# EAGLE design BEP31_RPM_BAR switchedRES_2 (EAGLE 6.5.0)
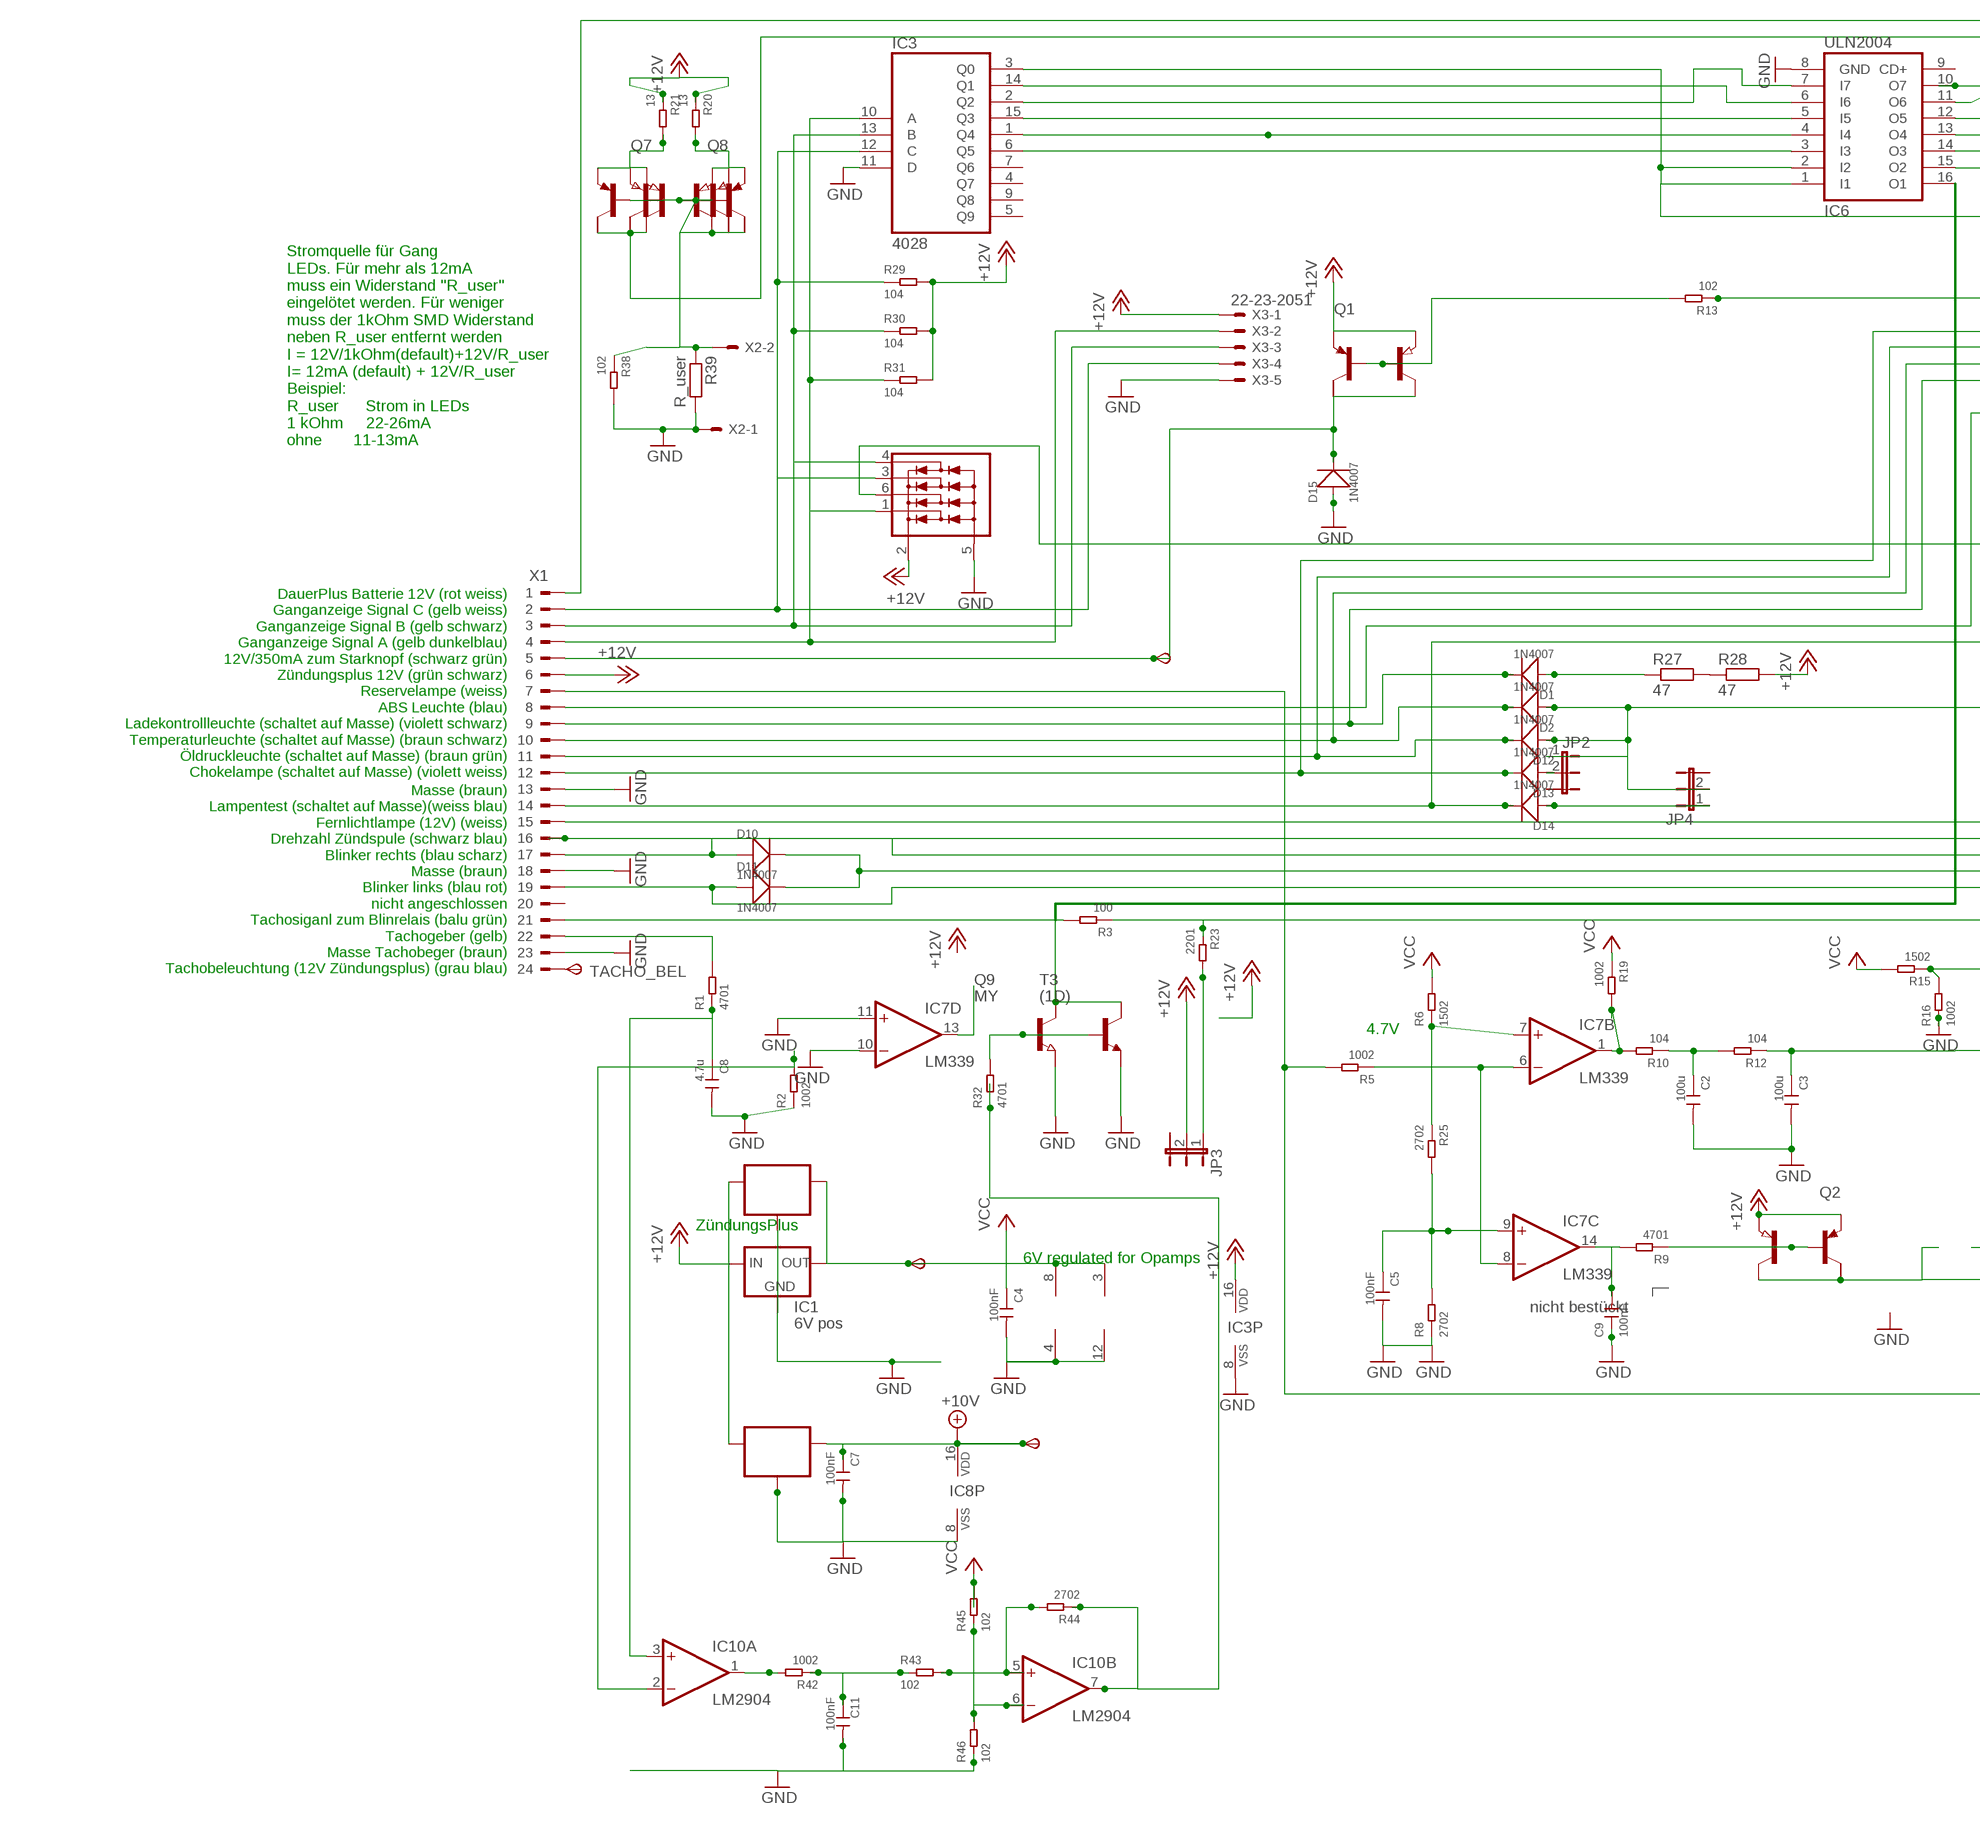
[diagram p0: schematic, sheet 1, part 1 of 2]
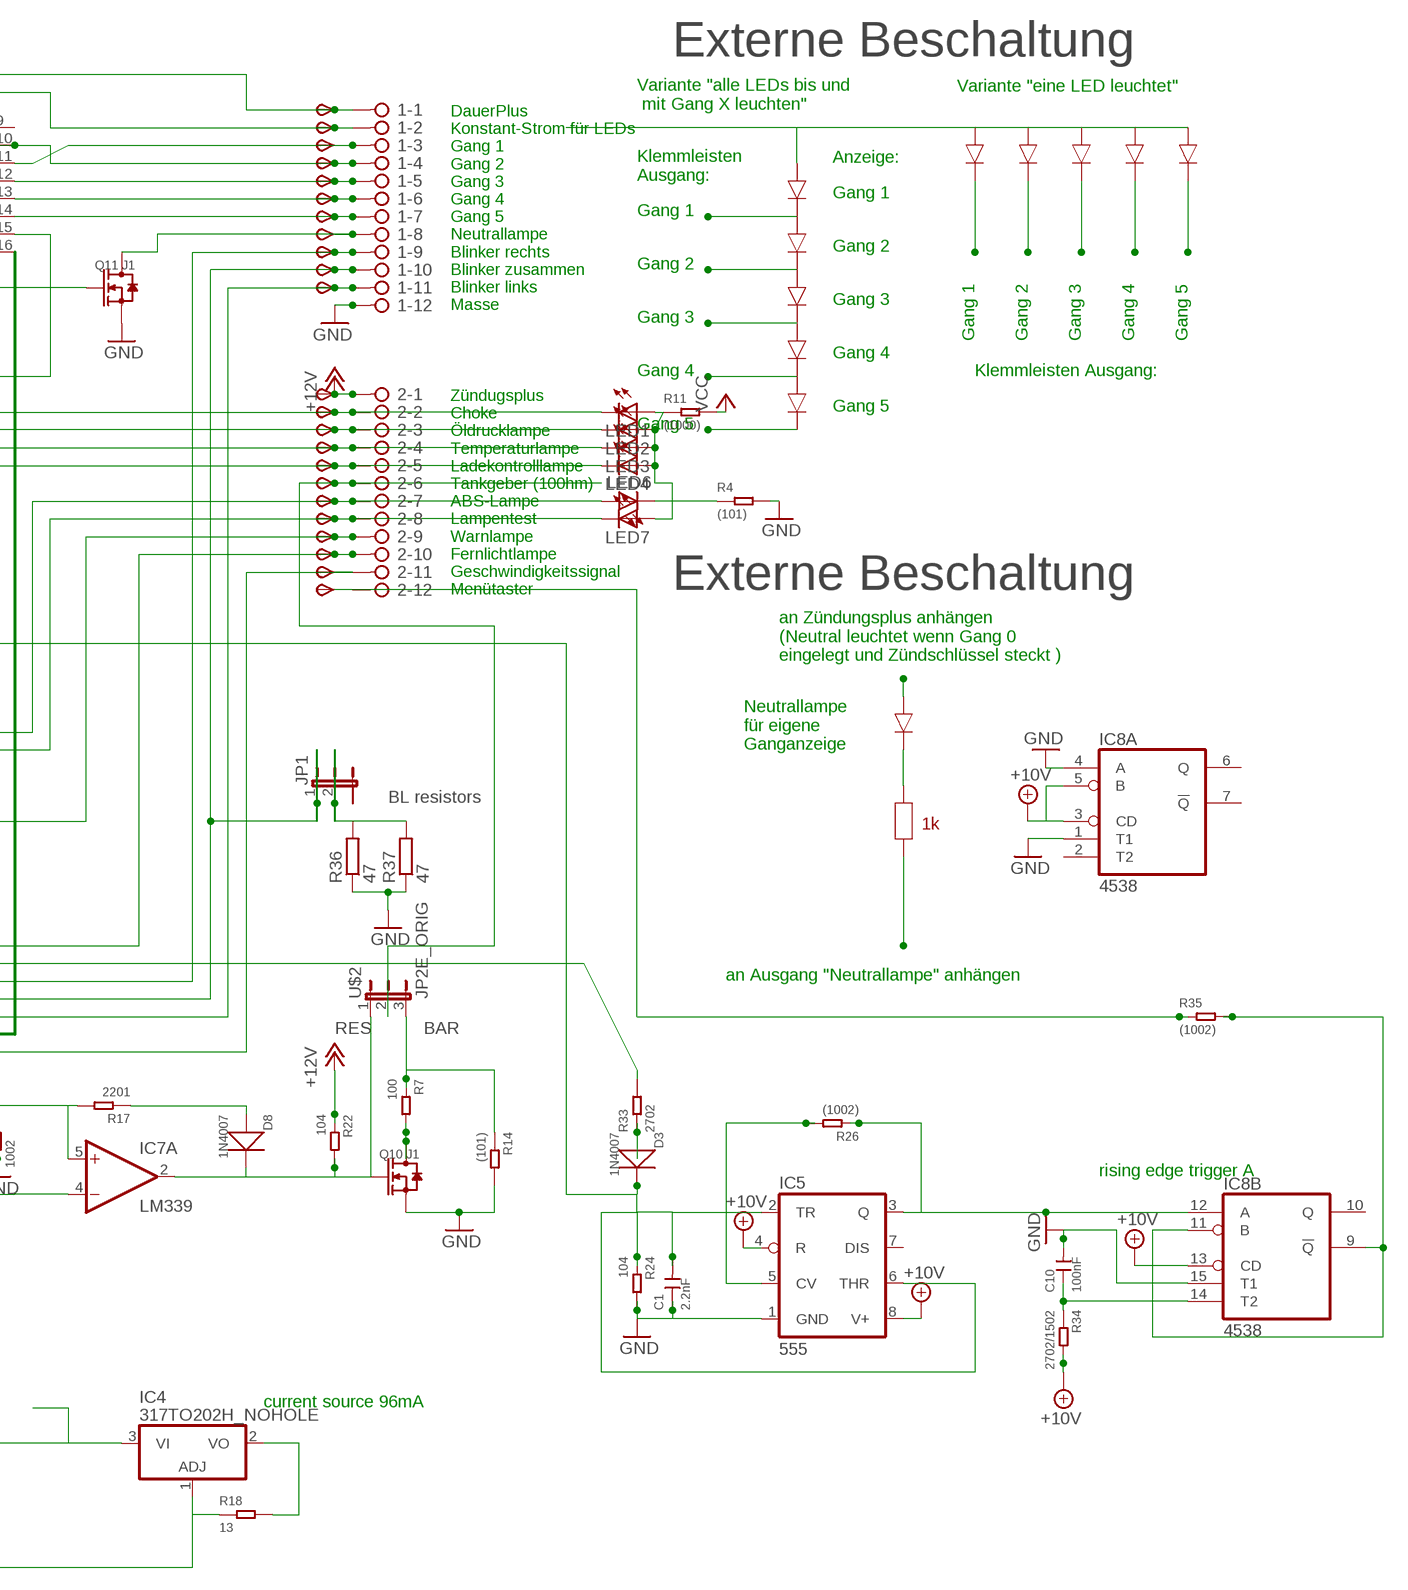
[diagram p1: schematic, sheet 1, part 2 of 2]

## Parts
1  2081-1132  [12-PIN]
2  2081-1132  [12-PIN]
6V  TPSB2.0  [B2.0]
10V  TPSB2.0  [B2.0]
C1  2.2nF  CERAMIC-100NF-50V-10%-X7R(0805)  [C0805]
C2  100u  CERAMIC-100UF-6.3V-20%-X5R(1206)  [C1206]
C3  100u  CERAMIC-100UF-6.3V-20%-X5R(1206)  [C1206]
C4  100nF  CERAMIC-100NF-50V-10%-X7R(0805)  [C0805]
C5  100nF  CERAMIC-100NF-50V-10%-X7R(0805)  [C0805]
C7  100nF  CERAMIC-100NF-50V-10%-X7R(0805)  [C0805]
C8  4.7u  CERAMIC-4.7UF-25V-10%-X5R(0805)  [C0805]
C9  100nF  CERAMIC-100NF-50V-10%-X7R(0805)  [C0805]
C10  100nF  CERAMIC-100NF-50V-10%-X7R(0805)  [C0805]
C11  100nF  CERAMIC-100NF-50V-10%-X7R(0805)  [C0805]
D1  1N4007  DIODE-GEN-PURPOSE-1KV-1A(DO-214AC)  [DO-214AC]
D2  1N4007  DIODE-GEN-PURPOSE-1KV-1A(DO-214AC)DO-214AC/1206  [DO-214AC-1206MOUNT]
D3  1N4007  DIODE-GEN-PURPOSE-1KV-1A(DO-214AC)  [DO-214AC]
D8  1N4007  DIODE-GEN-PURPOSE-1KV-1A(DO-214AC)  [DO-214AC]
D10  1N4007  DIODE-GEN-PURPOSE-1KV-1A(DO-214AC)  [DO-214AC]
D11  1N4007  DIODE-GEN-PURPOSE-1KV-1A(DO-214AC)  [DO-214AC]
D12  1N4007  DIODE-GEN-PURPOSE-1KV-1A(DO-214AC)DO-214AC/1206  [DO-214AC-1206MOUNT]
D13  1N4007  DIODE-GEN-PURPOSE-1KV-1A(DO-214AC)DO-214AC/1206  [DO-214AC-1206MOUNT]
D14  1N4007  DIODE-GEN-PURPOSE-1KV-1A(DO-214AC)DO-214AC/1206  [DO-214AC-1206MOUNT]
D15  1N4007  DIODE-GEN-PURPOSE-1KV-1A(DO-214AC)  [DO-214AC]
IC1  6V pos  78LXX  [78LXX]
IC2  78LXXSOT89_ROUND  [SOT89_ROUND]
IC3  4028  4028D  [SO16]
IC4  317TO202H_NOHOLE  [TO220H_NOHOLE]
IC5  555  NE555D  [SO08]
IC6  ULN2004  ULN2004AD  [SO16]
IC7  LM339  LM339D  [SO14]
IC8  4538  4538D  [SO16]
IC9  78LXXSOT89_ROUND  [SOT89_ROUND]
IC10  LM2904  LM358D  [SO08]
JP1  JP2EJP2_SMALLPADS  [JP2_SMALLPADS]
JP2  JP2EJP2_SMALLPADS  [JP2_SMALLPADS]
JP3  JP2EJP2_SMALLPADS  [JP2_SMALLPADS]
JP4  JP2EJP2_SMALLPADS  [JP2_SMALLPADS]
LED1  LEDLD260  [LD260]
LED2  LEDLD260  [LD260]
LED3  LEDLD260  [LD260]
LED4  LEDLD260  [LD260]
LED6  LEDLD260  [LD260]
LED7  LEDLD260  [LD260]
Q1  PNP-TRANSISTOR_SOT89  [SOT89]
Q2  PNP-TRANSISTOR_SOT89  [SOT89]
Q3  AH-16  BCP53T1  [SOT223]
Q4  (AH-16)  BCP53T1  [SOT223]
Q5  (AH-16)  BCP53T1  [SOT223]
Q6  (AH-16)  BCP53T1  [SOT223]
Q7  PNP-TRANSISTOR_SOT89  [SOT89]
Q8  PNP-TRANSISTOR_SOT89  [SOT89]
Q9  MY  NPN-TRANSISTOR_SOT89  [SOT89]
Q10  J1  SMD-MOSFET-N-CH-50V-200MA-BSS138W-7-F(SOT-23)  [SOT-23]
Q11  J1  SMD-MOSFET-N-CH-50V-200MA-BSS138W-7-F(SOT-23)  [SOT-23]
R1  4701  SMD-RES-4.7K-5%-1/8W(0805)  [R0805]
R2  1002  SMD-RES-10K-1%-1/8W(0805)  [R0805]
R3  100  SMD-RES-220R-5%-1/8W(0805)  [R0805]
R4  (101)  SMD-RES-100R-5%-1/8W(0805)  [R0805]
R5  1002  SMD-RES-10K-1%-1/8W(0805)  [R0805]
R6  1502  SMD-RES-10K-1%-1/8W(0805)  [R0805]
R7  100  SMD-RES-2.2K-5%-1/8W(0805)  [R0805]
R8  2702  SMD-RES-4.7K-5%-1/8W(0805)  [R0805]
R9  4701  SMD-RES-4.7K-5%-1/8W(0805)  [R0805]
R10  104  SMD-RES-10K-1%-1/8W(0805)  [R0805]
R11  (1000)  SMD-RES-100R-5%-1/8W(0805)  [R0805]
R12  104  SMD-RES-10K-1%-1/8W(0805)  [R0805]
R13  102  SMD-RES-1K-5%-1/8W(0805)  [R0805]
R14  (101)  SMD-RES-2.2K-5%-1/8W(0805)  [R0805]
R15  1502  SMD-RES-10K-1%-1/8W(0805)  [R0805]
R16  1002  SMD-RES-10K-1%-1/8W(0805)  [R0805]
R17  2201  SMD-RES-2.2K-5%-1/8W(0805)  [R0805]
R18  13  SMD-RES-13R-5%-1/4W(1206)  [R1206]
R19  1002  SMD-RES-10K-1%-1/8W(0805)  [R0805]
R20  13  SMD-RES-13R-5%-1/4W(1206)  [R1206]
R21  13  SMD-RES-13R-5%-1/4W(1206)  [R1206]
R22  104  SMD-RES-10K-1%-1/8W(0805)  [R0805]
R23  2201  SMD-RES-2.2K-5%-1/8W(0805)  [R0805]
R24  104  SMD-RES-10K-1%-1/8W(0805)  [R0805]
R25  2702  SMD-RES-4.7K-5%-1/8W(0805)  [R0805]
R26  (1002)  SMD-RES-10K-1%-1/8W(0805)  [R0805]
R27  47  R-EU_V235/17_1MM  [V235/17_1MM]
R28  47  R-EU_V235/17_1MM  [V235/17_1MM]
R29  104  SMD-RES-10K-1%-1/8W(0805)  [R0805]
R30  104  SMD-RES-10K-1%-1/8W(0805)  [R0805]
R31  104  SMD-RES-10K-1%-1/8W(0805)  [R0805]
R32  4701  SMD-RES-4.7K-5%-1/8W(0805)  [R0805]
R33  2702  SMD-RES-10K-1%-1/8W(0805)  [R0805]
R34  2702/1502  SMD-RES-4.7K-5%-1/8W(0805)  [R0805]
R35  (1002)  SMD-RES-4.7K-5%-1/8W(0805)  [R0805]
R36  47  R-EU_V235/17_1MM  [V235/17_1MM]
R37  47  R-EU_V235/17_1MM  [V235/17_1MM]
R38  102  SMD-RES-1K-5%-1/8W(0805)  [R0805]
R39  R_user  R-EU_R0805  [R0805]
R42  1002  SMD-RES-10K-1%-1/8W(0805)  [R0805]
R43  102  SMD-RES-1K-5%-1/8W(0805)  [R0805]
R44  2702  SMD-RES-4.7K-5%-1/8W(0805)  [R0805]
R45  102  SMD-RES-1K-5%-1/8W(0805)  [R0805]
R46  102  SMD-RES-1K-5%-1/8W(0805)  [R0805]
START  TPSB2.0  [B2.0]
T1  PNP2SM8  [SM8]
T3  (1D)  MMBTA42LT1-NPN-SOT23-BEC  [SOT23-BEC]
TACHO_BEL  TPSP1_1MM  [P1_1.0MM]
TP1  TPSB2.0  [B2.0]
TP2  TPSB2.0  [B2.0]
TP3  TPSB2.0  [B2.0]
TP4  TPSB2.0  [B2.0]
TP5  TPSB2.0  [B2.0]
TP6  TPSB2.0  [B2.0]
TP7  TPSB2.0  [B2.0]
TP8  TPSB2.0  [B2.0]
TP9  TPSB2.0  [B2.0]
TP10  TPSB2.0  [B2.0]
TP11  TPSB2.0  [B2.0]
TP12  TPSB2.0  [B2.0]
TP13  TPSB2.0  [B2.0]
TP16  TPSB2.0  [B2.0]
TP17  TPSB2.0  [B2.0]
TP18  TPSB2.0  [B2.0]
TP19  TPSB2.0  [B2.0]
TP21  TPSB2.0  [B2.0]
TP22  TPSB2.0  [B2.0]
TP23  TPSB2.0  [B2.0]
TP24  TPSB1,27  [B1,27]
TP25  TPSB2.0  [B2.0]
TP26  TPSB2.0  [B2.0]
U$2  JP2E_ORIG  [JP2_ORIG_SMALLPADS]
U$3  NUP4304SOT457_R  [SOT457R_PHILIPS]
X1  CON_BMWV2  [24-PIN_V2]
X2  22-23-2021  [22-23-2021]
X3  22-23-2051  [22-23-2051]

## Nets
+10V: 10V.TP(PP) C7.1 IC5.4(R) IC5.8(V+) IC8.3(A:CD) IC8.5(A:B) IC8.13(B:CD) IC8.16(P:VDD) IC9.1(OUT) R34.2
+12V: 2.1 IC1.IN IC2.3(IN) IC3.16(VDD) IC9.3(IN) JP3.2 Q1.3(E) Q2.3(E) Q3.3(E) Q4.3(E) R20.1 R21.1 R22.1 R28.2 R29.2 R30.2 R31.2 TP12.TP(PP) U$3.2(V+) X1.6 X3.1
+12V1: IC10.7(B:OUT) R32.1 R44.1
GND: 1.12 C1.1 C2.2 C3.2 C4.2 C5.2 C7.2 C8.2 C9.1 C10.2 C11.2 D15.1(+) IC1.GND IC2.2(GND) IC2.2@1(GND) IC3.8(VSS) IC3.11(D) IC5.1(GND) IC6.8(GND) IC7.10(D:-IN) IC7.11(D:+IN) IC7.12(P:GND) IC8.1(A:T1) IC8.4(A:A) IC8.8(P:VSS) IC8.15(B:T1) IC9.2(GND) IC9.2@1(GND) IC10.4(P:V-) Q9.3(E) Q10.2(S) Q11.2(S) R2.1 R4.2 R8.1 R14.2 R16.1 R24.2 R36.1 R37.1 R38.2 R39.2 R46.1 T3.E U$3.5(V-) X1.13 X1.18 X1.23 X2.1 X3.5
N$1: 2.9 D2.1(+) D12.1(+) JP2.1 JP4.2 TP24.TP(PP)
N$2: IC3.10(A) R31.1 U$3.1(D1) X1.4 X3.2
N$3: IC3.13(B) R30.1 U$3.4(D4) X1.3 X3.3
N$4: 2.7 LED6.A TP22.TP(PP) X1.8
N$5: Q5.3(E) Q8.3(E) R21.2 T1.1(B:E)
N$6: D8.2(-) IC7.2(A:OUT) Q10.1(G) R22.2 U$2.1
N$7: IC10.2(A:-IN) R2.2
N$8: R27.2 R28.1
N$9: Q6.3(E) Q7.3(E) R20.2 T1.3(A:E)
N$11: D15.2(-) Q1.2(C) Q3.2(C) START.TP(PP) X1.5
N$12: 2.2 D13.2(-) LED1.K(C) TP16.TP(PP) X1.12
N$13: 2.3 D12.2(-) LED2.K(C) TP17.TP(PP) X1.11
N$14: 2.4 D2.2(-) LED3.K(C) TP18.TP(PP) X1.10
N$15: IC4.3(VI) Q2.2(C) Q4.2(C)
N$16: IC7.6(B:-IN) IC7.8(C:-IN) R5.1
N$17: IC3.12(C) R29.1 U$3.3(D3) X1.2 X3.4
N$18: IC3.15(Q3) IC6.5(I5)
N$19: 2.8 D14.2(-) LED7.K(C) TP23.TP(PP) X1.14
N$20: 1.9 D10.1(+) TP9.TP(PP) X1.17
N$21: 1.11 D11.1(+) TP11.TP(PP) X1.19
N$22: IC8.9(B:!Q) IC8.11(B:B) R35.2
N$23: R1.2 X1.22
N$24: C8.1 IC10.3(A:+IN) R1.1
N$25: 1.6 IC6.13(O4) TP6.TP(PP)
N$26: 1.7 IC6.14(O3) TP7.TP(PP)
N$27: 2.11 R3.1 R23.1 TP26.TP(PP)
N$28: 2.6 TP21.TP(PP) U$2.2
N$29: JP3.1 R23.2
N$30: C5.1 IC7.9(C:+IN) R8.2 R25.2
N$31: C9.2 IC7.14(C:OUT) R9.2
N$32: C1.2 D3.2(-) IC5.2(TR) IC5.6(THR) R24.1 U$3.6(D2)
N$34: LED6.K(C) R4.1
N$35: IC4.1(ADJ) R5.2 R18.1 X1.7
N$36: Q2.1(B) Q4.1(B) R9.1
N$37: IC3.2(Q2) IC6.7(I7)
N$38: 1.3 IC6.11(O6) TP3.TP(PP)
N$39: 1.5 IC6.12(O5) TP5.TP(PP)
N$41: LED1.A LED2.A LED3.A LED4.A LED7.A R11.1
N$42: R33.2 X1.16
N$43: Q1.1(B) Q3.1(B) R13.2
N$44: IC3.3(Q0) IC6.1(I1) IC6.2(I2) Q11.1(G)
N$45: C2.1 R10.1 R12.2
N$46: C3.1 IC7.4(A:-IN) R12.1
N$47: IC7.5(A:+IN) R15.1 R16.2 R17.2
N$48: Q10.3(D) R7.2
N$49: D8.1(+) R17.1
N$50: IC3.1(Q4) IC6.4(I4)
N$52: 1.8 Q11.3(D) TP8.TP(PP)
N$53: 2.10 TP25.TP(PP) X1.15
N$54: D1.1(+) R27.1
N$55: 2.5 D1.2(-) LED4.K(C) TP19.TP(PP) X1.9
N$56: IC3.14(Q1) IC6.6(I6)
N$57: Q5.1(B) Q6.1(B) Q6.2(C) Q7.1(B) Q7.2(C) Q8.1(B) R38.1 R39.1 T1.2(B:B) T1.4(A:B) T1.6(A:C1) X2.2
N$58: TACHO_BEL.TP(PP) X1.24
N$59: 1.2 Q5.2(C) Q8.2(C) T1.8(B:C1) TP2.TP(PP)
N$60: IC7.13(D:OUT)
N$61: IC3.6(Q5) IC6.3(I3)
N$64: IC4.2(VO) R18.2
N$65: IC5.5(CV) R26.2
N$67: 1.4 IC6.10(O7) TP4.TP(PP)
N$69: 1.1 TP1.TP(PP) X1.1
N$83: IC7.7(B:+IN) R6.1 R25.1
N$84: IC6.16(O1) Q9.2(C) R3.2 T3.C X1.21
N$85: Q9.1(B) R32.2 T3.B
N$86: IC5.3(Q) IC8.12(B:A) R26.1
N$87: D3.1(+) R33.1
N$88: IC6.15(O2) R13.1
N$89: C10.1 IC8.14(B:T2) R34.1
N$90: 2.12 R35.1 TP13.TP(PP)
N$92: IC10.1(A:OUT) R42.2
N$93: 1.10 D10.2(-) D11.2(-) JP1.1 TP10.TP(PP)
N$94: JP1.2 R36.2 R37.2
N$95: D13.1(+) JP2.2
N$96: C11.1 R42.1 R43.1
N$97: IC10.5(B:+IN) R43.2 R44.2
N$98: D14.1(+) JP4.1
N$99: R7.1 R14.1 U$2.3
N$101: IC10.6(B:-IN) R45.1 R46.2
N$580: IC7.1(B:OUT) R10.2 R19.2
VCC: 6V.TP(PP) C4.1 IC1.OUT IC2.1(OUT) IC7.3(P:V+) IC10.8(P:V+) R6.2 R11.2 R15.2 R19.1 R45.2
Unconnected: IC3.4(Q7) IC3.5(Q9) IC3.7(Q6) IC3.9(Q8) IC5.7(DIS) IC6.9(CD+) IC8.2(A:T2) IC8.6(A:Q) IC8.7(A:!Q) IC8.10(B:Q) Q3.4(C/) Q4.4(C/) Q5.4(C/) Q6.4(C/) T1.5(A:C) T1.7(B:C) X1.20

## Notes on the sheet
- Externe Beschaltung
- Variante "eine LED leuchtet"
- Variante "alle LEDs bis und
   mit Gang X leuchten"
- Anzeige:
- Klemmleisten
  Ausgang:
- Gang 1
- DauerPlus
  Konstant-Strom für LEDs
  Gang 1
  Gang 2
  Gang 3
  Gang 4
  Gang 5
  Neutrallampe
  Blinker rechts
  Blinker zusammen
  Blinker links
  Masse
- Gang 1
- Gang 2
- Gang 2
- Gang 3
- Gang 3
- Gang 1 | Gang 2 | Gang 3 | Gang 4 | Gang 5
- Gang 4
- Gang 4 | Klemmleisten Ausgang:
- Gang 5
- Gang 5
- Zündugsplus
  Choke
  Öldrucklampe
  Temperaturlampe
  Ladekontrolllampe
  Tankgeber (100hm)
  ABS-Lampe
  Lampentest
  Warnlampe
  Fernlichtlampe
  Geschwindigkeitssignal
  Menütaster
- Stromquelle für Gang
  LEDs. Für mehr als 12mA
  muss ein Widerstand "R_user"
  eingelötet werden. Für weniger
  muss der 1kOhm SMD Widerstand
  neben R_user entfernt werden
  I = 12V/1kOhm(default)+12V/R_user
  I= 12mA (default) + 12V/R_user
  Beispiel:
  R_user      Strom in LEDs
  1 kOhm     22-26mA
  ohne       11-13mA
- Externe Beschaltung
- an Zündungsplus anhängen
  (Neutral leuchtet wenn Gang 0
  eingelegt und Zündschlüssel steckt )
- Neutrallampe
  für eigene
  Ganganzeige
- DauerPlus Batterie 12V (rot weiss)
  Ganganzeige Signal C (gelb weiss)
  Ganganzeige Signal B (gelb schwarz)
  Ganganzeige Signal A (gelb dunkelblau)
  12V/350mA zum Starknopf (schwarz grün)
  Zündungsplus 12V (grün schwarz)
  Reservelampe (weiss)
  ABS Leuchte (blau)
  Ladekontrollleuchte (schaltet auf Masse) (violett schwarz)
  Temperaturleuchte (schaltet auf Masse) (braun schwarz)
  Öldruckleuchte (schaltet auf Masse) (braun grün)
  Chokelampe (schaltet auf Masse) (violett weiss)
- BL resistors
- 1k
- an Ausgang "Neutrallampe" anhängen
- Masse (braun)
  Lampentest (schaltet auf Masse)(weiss blau)
  Fernlichtlampe (12V) (weiss)
  Drehzahl Zündspule (schwarz blau)
  Blinker rechts (blau scharz)
  Masse (braun)
  Blinker links (blau rot)
  nicht angeschlossen
  Tachosiganl zum Blinrelais (balu grün)
  Tachogeber (gelb)
  Masse Tachobeger (braun)
  Tachobeleuchtung (12V Zündungsplus) (grau blau)
- RES | BAR
- 4.7V | rising edge trigger A
- ZündungsPlus
- current source 96mA
- 6V regulated for Opamps
- nicht bestückt

## Library data of the parts
1 2 = con WAGO BMW:2081-1132: WAGO SREW CLAMP
6V 10V START TACHO_BEL TP1-TP13 TP16-TP19 TP21-TP26 = testpin_BMW:TPS: TEST PIN
C1 C4 C5 C7 C9-C11 = Seeed-Capacitor-2016:CERAMIC-100NF-50V-10%-X7R(0805): 302010165; MPN: CC0805KRX7R9BB104; VALUE: 100nf
C2 C3 = Seeed-Capacitor-2016:CERAMIC-100UF-6.3V-20%-X5R(1206): 302010183; MPN: GRM31CR60J107ME39L; VALUE: 100uf
C8 = Seeed-Capacitor-2016:CERAMIC-4.7UF-25V-10%-X5R(0805): 302010146; MPN: CC0805KKX5R8BB475; VALUE: 4.7uf
D1 D3 D8 D10 D11 D15 = Diode-do214ac:DIODE-GEN-PURPOSE-1KV-1A(DO-214AC): 304010013; MPN: 1N4007
D2 D12-D14 = Diode-do214ac:DIODE-GEN-PURPOSE-1KV-1A(DO-214AC): 304010013
IC1 = v-reg:78LXX: VOLTAGE REGULATOR
IC2 IC9 = 78LXX:78LXX
IC3 = 4028:4028: BCD to decimal DECODER
IC4 = linear_BMW:*317: Positive VOLTAGE REGULATOR
IC5 = linear:*555: TIMER
IC6 = uln-udn:ULN2004A: DRIVER ARRAY
IC7 = LM339:LM339: Low Power Low Offset Voltage Quad Comparators with open collector; LM139/LM239/LM339/LM2901/LM3302
IC8 = 45xx:4538: Dual precision monostable MULTIVIBRATOR
IC10 = linear_BMW:LM358: OP AMP also LM158; LM258; LM2904 Source: http://cache.national.com/ds/LM/LM158.pdf
JP1-JP4 = Switch Aliexpress:JP2E: JUMPER
LED1-LED4 LED6 LED7 = led:LED: LED OSRAM: - CHIPLED LG R971, LG N971, LY N971, LG Q971, LY Q971, LO R971, LY R971 LH N974, LH R974 LS Q976, LO Q976, LY Q976 LO Q996 - Hyper CHIPLED LW Q18S LB Q993, LB Q99A, LB R99A - SideLED LS A670, LO A670, LY A670, LG A670, LP A670 LB A673, LV A673, LT A673, LW A673 LH A674 LY A675 LS A676, LA A676, LO A676, LY A676, LW A676 LS A679, LY A679, LG A679 - Hyper Micro SIDELED® LS Y876, LA Y876, LO Y876, LY Y876 LT Y87S - SmartLED LW L88C, LW L88S LB L89C, LB L89S, LG L890 LS L89K, LO L89K, LY L89K LS L896, LA L896, LO L896, LY L896 - TOPLED LS T670, LO T670, LY T670, LG T670, LP T670 LSG T670, LSP T670, LSY T670, LOP T670, LYG T670 LG T671, LOG T671, LSG T671 LB T673, LV T673, LT T673, LW T673 LH T674 LS T676, LA T676, LO T676, LY T676, LB T676, LH T676, LSB T676, LW T676 LB T67C, LV T67C, LT T67C, LS T67K, LO T67K, LY T67K, LW E67C LS E67B, LA E67B, LO E67B, LY E67B, LB E67C, LV E67C, LT E67C LW T67C LS T679, LY T679, LG T679 LS T770, LO T770, LY T770, LG T770, LP T770 LB T773, LV T773, LT T773, LW T773 LH T774 LS E675, LA E675, LY E675, LS T675 LS T776, LA T776, LO T776, LY T776, LB T776 LHGB T686 LT T68C, LB T68C - Hyper Mini TOPLED® LB M676 - Mini TOPLED Santana® LG M470 LS M47K, LO M47K, LY M47K Source: http://www.osram.convergy.de LUXEON: - LUMILED® LXK2-PW12-R00, LXK2-PW12-S00, LXK2-PW14-U00, LXK2-PW14-V00 LXK2-PM12-R00, LXK2-PM12-S00, LXK2-PM14-U00 LXK2-PE12-Q00, LXK2-PE12-R00, LXK2-PE12-S00, LXK2-PE14-T00, LXK2-PE14-U00 LXK2-PB12-K00, LXK2-PB12-L00, LXK2-PB12-M00, LXK2-PB14-N00, LXK2-PB14-P00, LXK2-PB14-Q00 LXK2-PR12-L00, LXK2-PR12-M00, LXK2-PR14-Q00, LXK2-PR14-R00 LXK2-PD12-Q00, LXK2-PD12-R00, LXK2-PD12-S00 LXK2-PH12-R00, LXK2-PH12-S00 LXK2-PL12-P00, LXK2-PL12-Q00, LXK2-PL12-R00 Source: www.luxeon.com KINGBRIGHT: KA-3528ASYC Source: www.kingbright.com
Q1 Q2 Q7 Q8 = Transistor_SOT89:PNP-TRANSISTOR_: PNP TRANSISTOR
Q3-Q6 = BCP53_:BCP53*
Q9 = Transistor_SOT89:NPN-TRANSISTOR_: NPN TRANSISTOR
Q10 Q11 = Seeed-Transistor-2016:SMD-MOSFET-N-CH-50V-200MA-BSS138W-7-F(SOT-23): 305030000; MPN: BSS138W-7-F; VALUE: BSS138W-7-F
R1 R8 R9 R25 R32 R34 R35 R44 = Seeed-Resistor-2016:SMD-RES-4.7K-5%-1/8W(0805): 301010306; MPN: RC0805JR-074K7L; VALUE: 4.7K
R2 R5 R6 R10 R12 R15 R16 R19 R22 R24 R26 R29-R31 R33 R42 = Seeed-Resistor-2016:SMD-RES-10K-1%-1/8W(0805): 301010361; MPN: RC0805FR-0710KL; VALUE: 10K
R3 = Seeed-Resistor-2016:SMD-RES-220R-5%-1/8W(0805): 301010315; MPN: RC0805JR-07220RL; VALUE: 220R
R4 R11 = Seeed-Resistor-2016:SMD-RES-100R-5%-1/8W(0805): 301010319; MPN: RC0805JR-07100RL; VALUE: 100R
R7 R14 R17 R23 = Seeed-Resistor-2016:SMD-RES-2.2K-5%-1/8W(0805): 301010333; MPN: RC0805JR-072K2L; VALUE: 2.2K
R13 R38 R43 R45 R46 = Seeed-Resistor-2016:SMD-RES-1K-5%-1/8W(0805): 301010311; MPN: RC0805JR-071KL; VALUE: 1K
R18 R20 R21 = Seeed-Resistor-2016:SMD-RES-13R-5%-1/4W(1206): 301010405; MPN: RC1206JR-0713RL; VALUE: 13R
R27 R28 R36 R37 R39 = rcl:R-EU_: RESISTOR, European symbol
T1 = PNP2SM8:PNP2SM8; OC_FARNELL: unknown; OC_NEWARK: unknown
T3 = transistor:*-NPN-: NPN Transistror BF959 corrected 2008.03.06
U$2 = Switch Aliexpress:JP2E_ORIG
U$3 = NUP4304_ESD_Diode_Array:NUP4304
X1 = con_BMW:CON_BMW: BMW CONNECTOR
X2 = con_Molex_BMW:22-23-2021: .100" (2.54mm) Center Header - 2 Pin; MF: MOLEX; MPN: 22-23-2021; OC_FARNELL: 1462926; OC_NEWARK: 25C3832
X3 = con_Molex_BMW:22-23-2051: .100" (2.54mm) Center Header - 5 Pin; MF: MOLEX; MPN: 22-23-2051; OC_FARNELL: 1462952; OC_NEWARK: 38C9178

## Board
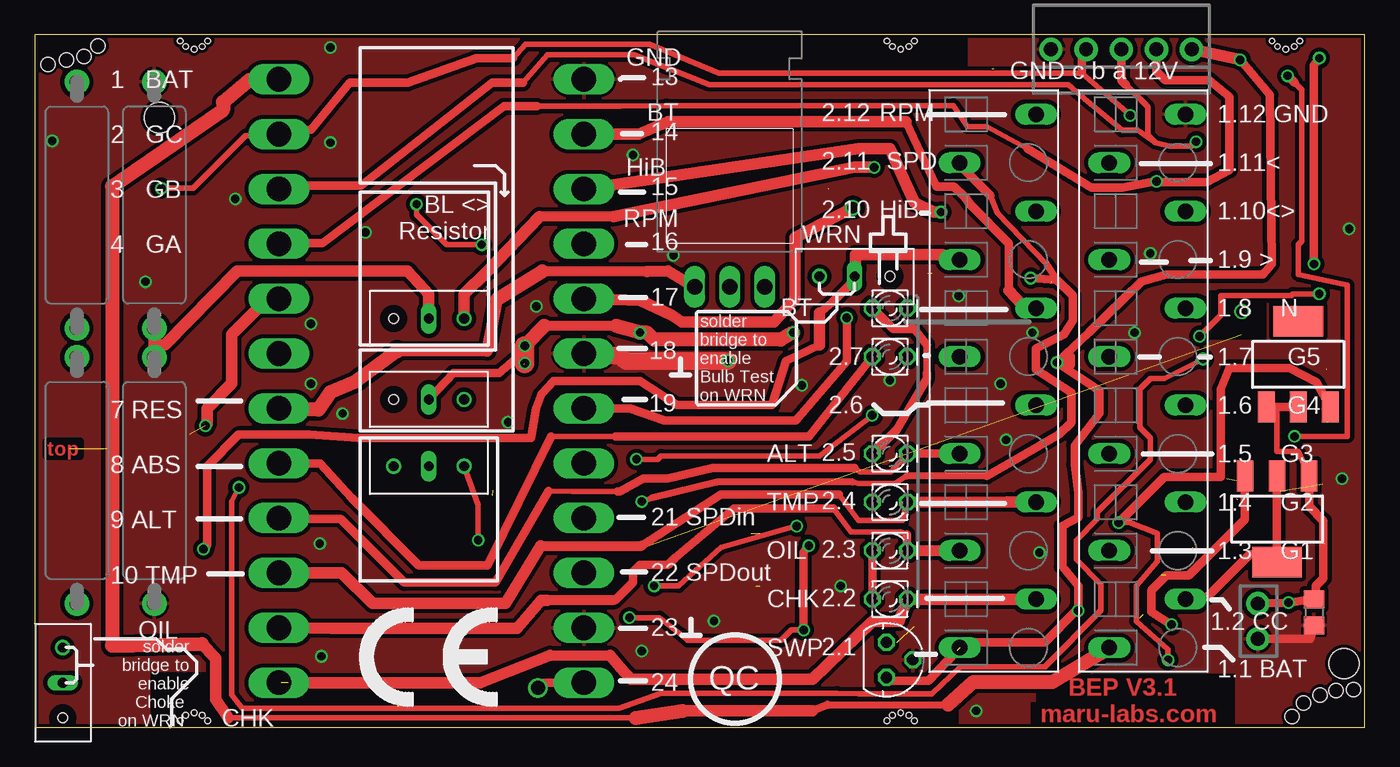
[diagram p2: board, top side]
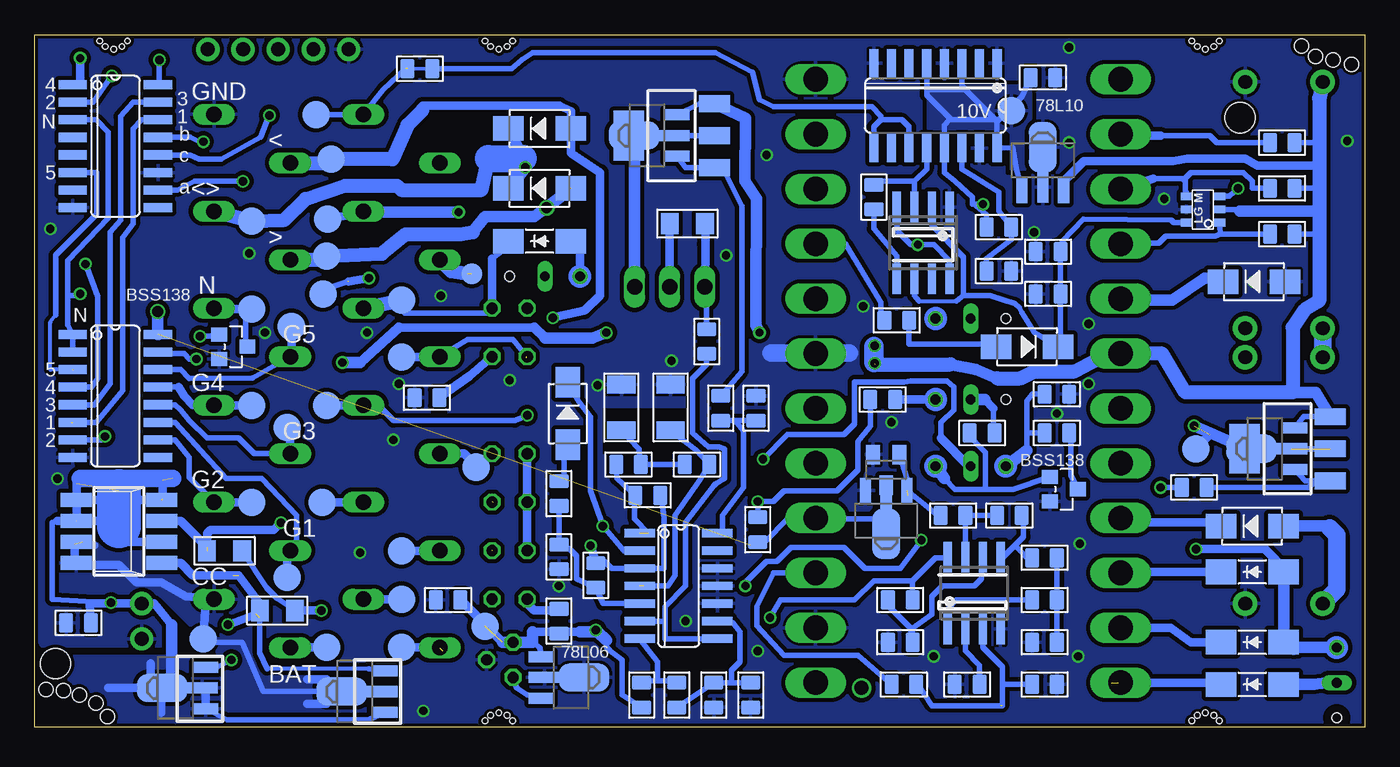
[diagram p3: board, bottom side, seen from below]

Size 96 x 50 mm. Coordinates in mm from the lower left corner, seen from the top.
Outline: 0,0 96,0 96,50 0,50 0,0
Copper layers (1*16): Top 0.035mm / dielectric 1.5mm / Bottom 0.035mm
Design rules "multi-cb_035um-cu *": minimum track width 6mil, minimum drill 12mil, track to track 12mil, track to pad 12mil, pad to pad 6mil, via to via 6mil, smd to smd 6mil, copper to edge 10mil, drill to drill 8mil, minimum pad ring 8mil, minimum via ring 6mil, stop-mask expansion 3mil, vias tented up to drill 0mil, thermal gap 8mil
Holes 1.02 mm at 95.19,2.71 93.92,2.64 92.77,2.33 91.57,1.75 90.76,0.77 0.95,47.86 2.29,48.17 3.56,48.43 4.57,49.19
Holes 2.18 mm at 94.5,4.6 9,44
Holes 0.4 mm at 62.5,1.06 61.9,0.86 61.5,0.46 63.1,0.86 63.5,0.46 11.5,1.06 10.9,0.86 10.5,0.46 12.1,0.86 12.5,0.46 11.5,48.94 12.1,49.14 12.5,49.54 10.9,49.14 10.5,49.54 62.5,48.94 63.1,49.14 63.5,49.54 61.9,49.14 61.5,49.54 90.3,48.94 90.9,49.14 91.3,49.54 89.7,49.14 89.3,49.54
tRestrict: area 76.4,0.3 to 86.6,3.8; area 71.9,0.3 to 76.5,1.8; area 60.2,0 to 66.7,2.2; area 60.8,47.4 to 67.3,49.8; area 8.4,0.2 to 14.4,4; area 84.6,28 to 88.9,31.5
bRestrict: area 48.5,19.7 to 55,23; area 32.6,10.2 to 33.3,11.1

### Footprints (pad centres in the part's own frame; a part is rotated, then mirrored left to right if it is on the bottom)
12-PIN = drill 1.118 long: 1 19.25,-2.45; 2 15.75,3.05; 3 12.25,-2.45; 4 8.75,3.05; 5 5.25,-2.45; 6 1.75,3.05; 7 -1.75,-2.45; 8 -5.25,3.05; 9 -8.75,-2.45; 10 -12.25,3.05; 11 -15.75,-2.45; 12 -19.25,3.05
B2.0 = smd 2 x 2: TP 0,0
C0805 = smd 1.397 x 1.016: 1 0,0.889; 2 0,-0.889
C1206 = smd 1.27 x 2.032: 1 -1.651,0; 2 1.651,0
DO-214AC = smd 2.2 x 1.77: 1 -2.242,0; 2 2.242,0
DO-214AC-1206MOUNT = smd 2.2 x 1.77: 1 -2.242,0; 2 2.242,0
78LXX = drill 0.813 octagon: GND 0,1.905; IN 1.27,0; OUT -1.27,0
SOT89_ROUND = smd 0.8 x 1.8: 1 -1.499,-2.181; 3 1.499,-2.181 | smd 0.8 x 2.3: 2 0,-1.927 | smd 2.032 x 3.65: 2@1 0,0.94
SO16 = smd 0.66 x 2.032: 1 -4.445,-3.073; 2 -3.175,-3.073; 3 -1.905,-3.073; 4 -0.635,-3.073; 5 0.635,-3.073; 6 1.905,-3.073; 7 3.175,-3.073; 8 4.445,-3.073; 9 4.445,3.073; 10 3.175,3.073; 11 1.905,3.073; 12 0.635,3.073; 13 -0.635,3.073; 14 -1.905,3.073; 15 -3.175,3.073; 16 -4.445,3.073
TO220H_NOHOLE = drill 1.118 long: 1 -2.54,-10.16; 2 0,-10.16; 3 2.54,-10.16
SO08 = smd 0.6 x 2.2: 1 -1.905,-2.6; 2 -0.635,-2.6; 3 0.635,-2.6; 4 1.905,-2.6; 5 1.905,2.6; 6 0.635,2.6; 7 -0.635,2.6; 8 -1.905,2.6
SO14 = smd 0.6 x 2.2: 1 -3.81,-2.8; 2 -2.54,-2.8; 3 -1.27,-2.8; 4 0,-2.8; 5 1.27,-2.8; 6 2.54,-2.8; 7 3.81,-2.8; 8 3.81,2.8; 9 2.54,2.8; 10 1.27,2.8; 11 0,2.8; 12 -1.27,2.8; 13 -2.54,2.8; 14 -3.81,2.8
JP2_SMALLPADS = drill 0.7: 1 -2.54,0 | drill 0.7 long: 2 0,0 | hole 0.7: 2.54,0
LD260 = drill 0.813 octagon: A -1.27,0; K 1.27,0
SOT89 = smd 0.8 x 1.8: 1 -1.499,-2.181; 3 1.499,-2.181 | smd 0.8 x 2.3: 2 0,-1.927 | smd 2.032 x 3.65: 2@1 0,0.94
SOT223 = smd 1.219 x 2.235: 1 -2.311,-3.099; 2 0,-3.099; 3 2.311,-3.099 | smd 3.6 x 2.2: 4 0,3.099
SOT-23 = smd 1.016 x 1.143: 1 -0.889,-1.016; 2 0.889,-1.016; 3 0,1.016
R0805 = smd 1.397 x 1.016: 1 0,0.889; 2 0,-0.889
R1206 = smd 1.27 x 1.524: 1 -1.27,0; 2 1.27,0
V235/17_1MM = drill 1 pad 1.778: 1 -8.89,0; 2 8.89,0
R0805' = smd 1.3 x 1.5: 1 -0.95,0; 2 0.95,0
SM8 = smd 1.016 x 2.235: 1 -2.286,-3.099; 2 -0.762,-3.099; 3 0.762,-3.099; 4 2.286,-3.099; 5 2.286,3.099; 6 0.762,3.099; 7 -0.762,3.099; 8 -2.286,3.099
SOT23-BEC = smd 1 x 1.4: B -0.95,-1.1; C 0,1.1; E 0.95,-1.1
P1_1.0MM = drill 1.016: TP 0,0
B1,27 = smd 1.5 x 1.5: TP 0,0
JP2_ORIG_SMALLPADS = drill 0.7: 1 -2.54,0; 3 2.54,0 | drill 0.7 long: 2 0,0
SOT457R_PHILIPS = smd 0.55 x 0.8: 1 -0.95,-1.2; 2 0,-1.2; 3 0.95,-1.2; 4 0.95,1.2; 5 0,1.2; 6 -0.95,1.2
24-PIN_V2 = drill 1.778 long: 1 -21.78,-11; 2 -17.82,-11; 3 -13.86,-11; 4 -9.9,-11; 5 -5.94,-11; 6 -1.98,-11; 7 1.98,-11; 8 5.94,-11; 9 9.9,-11; 10 13.86,-11; 11 17.82,-11; 12 21.78,-11; 13 -21.78,11; 14 -17.82,11; 15 -13.86,11; 16 -9.9,11; 17 -5.94,11; 18 -1.98,11; 19 1.98,11; 20 5.94,11; 21 9.9,11; 22 13.86,11; 23 17.82,11; 24 21.78,11
22-23-2021 = drill 1 pad 1.676: 1 -1.27,0; 2 1.27,0
22-23-2051 = drill 1 pad 1.676: 1 -5.08,0; 2 -2.54,0; 3 0,0; 4 2.54,0; 5 5.08,0

### Placement (x,y rotation side)
1  80.01,25 270 top
2  69.22,25 270 top
6V  63.5,7.28 0 bottom
10V  25.5,44.5 0 bottom
C1  22.86,31.28 90 bottom
C2  53.66,23.09 90 bottom
C3  50.1,23.09 90 bottom
C4  66.17,9.18 270 bottom
C5  46.99,2.33 0 bottom
C7  23.24,46.9 90 bottom
C8  23.11,3.09 90 bottom
C9  43.94,23.03 0 bottom
C10  26.42,32.93 90 bottom
C11  23.11,6.14 270 bottom
D1  8.13,14.52 180 bottom
D2  8.13,11.22 180 bottom
D3  24.38,27.47 0 bottom
D8  57.53,22.65 90 bottom
D10  59.56,38.9 180 bottom
D11  59.56,43.22 180 bottom
D12  8.13,6.14 180 bottom
D13  8.13,3.09 180 bottom
D14  59.56,35.09 180 bottom
D15  8,32.17 180 bottom
IC1  61.47,4.87 270 top
IC2  57.28,3.6 270 bottom
IC3  90.17,41.95 270 bottom
IC4  50.16,41.95 0 top
IC5  31.88,34.97 180 bottom
IC6  90.17,23.92 270 bottom
IC7  49.53,10.2 270 bottom
IC8  30.99,44.87 180 bottom
IC9  23.24,40.93 0 bottom
IC10  28.19,9.69 0 bottom
JP1  28.45,29.5 180 top
JP2  2.03,3.21 270 top
JP3  28.45,23.66 180 top
JP4  59.18,32.55 0 top
LED1  61.72,9.25 0 top
LED2  61.72,12.75 0 top
LED3  61.72,16.25 0 top
LED4  61.72,19.75 0 top
LED6  61.72,26.75 0 top
LED7  61.72,30.25 0 top
Q1  7.24,20.11 90 bottom
Q2  51.82,42.71 90 bottom
Q3  5.59,20.11 90 bottom
Q4  50.04,42.71 90 bottom
Q5  89.66,15.03 180 top
Q6  91.19,26.2 0 top
Q7  85.85,2.83 90 bottom
Q8  72.9,2.58 90 bottom
Q9  34.54,14.9 180 bottom
Q10  21.72,17.18 270 bottom
Q11  81.66,27.47 270 bottom
R1  33.27,3.09 270 bottom
R2  28.7,3.09 90 bottom
R3  43.81,14.26 0 bottom
R4  67.69,23.79 270 bottom
R5  47.5,27.85 180 bottom
R6  52.2,2.33 0 bottom
R7  22.23,21.25 90 bottom
R8  44.32,2.33 180 bottom
R9  46.48,23.03 0 bottom
R10  53.15,18.96 270 bottom
R11  58.17,7.66 0 bottom
R12  48.2,18.96 270 bottom
R13  12.32,17.31 90 bottom
R14  22.23,24.04 90 bottom
R15  55.5,10.96 180 bottom
R16  58.17,12.3 180 bottom
R17  58.17,16.87 0 bottom
R18  48.9,36.36 180 bottom
R19  51.75,16.74 270 bottom
R20  82.3,12.74 180 bottom
R21  78.49,8.42 180 bottom
R22  27.62,21.25 270 bottom
R23  34.8,23.66 90 bottom
R24  22.86,34.33 270 bottom
R25  49.66,2.33 0 bottom
R26  35.43,38.27 0 bottom
R27  3.05,17.82 90 top
R28  3.05,37.7 90 top
R29  5.97,42.2 90 bottom
R30  5.97,38.9 90 bottom
R31  5.97,35.6 90 bottom
R32  29.72,15.28 270 bottom
R33  33.78,29.38 270 bottom
R34  26.42,36.11 270 bottom
R35  68.2,47.54 90 bottom
R36  8.64,17.82 90 top
R37  8.64,37.7 270 top
R38  92.84,7.53 270 bottom
R39  R_user  [R0805']  92.33,8.29 270 top
R42  23.11,9.18 270 bottom
R43  23.11,12.23 270 bottom
R44  25.65,15.28 90 bottom
R45  33.53,9.18 90 bottom
R46  33.53,6.14 90 bottom
START  12.19,20.11 0 bottom
T1  89.92,14.14 90 bottom
T3  34.54,18.58 180 bottom
TACHO_BEL  36.32,2.83 0 bottom
TP1  74.93,5.76 0 bottom
TP2  83.82,6.39 0 bottom
TP3  77.79,10.84 0 bottom
TP4  80.33,16.23 0 bottom
TP5  77.79,21.63 0 bottom
TP6  80.33,23.22 0 bottom
TP7  77.47,28.93 0 bottom
TP8  80.33,30.2 0 bottom
TP9  74.93,34.01 0 bottom
TP10  80.33,36.55 0 bottom
TP11  74.61,41 0 bottom
TP12  69.53,5.76 0 bottom
TP13  75.69,44.24 0 bottom
TP16  69.53,9.25 0 bottom
TP17  69.53,12.74 0 bottom
TP18  75.25,16.23 0 bottom
TP19  64.14,18.77 0 bottom
TP21  74.93,23.22 0 bottom
TP22  69.53,26.71 0 bottom
TP23  69.53,30.84 0 bottom
TP24  64.45,32.74 0 bottom
TP25  74.87,36.68 0 bottom
TP26  75.18,31.28 0 bottom
U$1  [CE_10.00]  23.37,1.44 0 top
U$2  28.45,18.84 180 top
U$3  11.68,37.38 90 bottom
X1  28.64,25 270 top
X2  88.27,7.66 90 top
X3  78.42,48.94 180 top

### Tracks (layer width: path | path; a pad name or v marks a point on that pad's centre or on a via)
+10V  (via drill 0.6)
  Top 0.406: v27.56,37.76 27.56,37 29.72,34.84 v32.26,34.84
  Bottom 0.406: 26.67,43.85 29.08,46.27 IC8.3 | 26.54,43.73 IC8.16 25.4,41.82 25.15,40.3 24.89,39.41 24.74,39.01 IC9.1 | 28.32,37.89 27.3,37 R34.2 | 29.84,43.85 29.97,43.85 30.35,43.47 IC8.13 30.35,40.05 29.59,39.41 28.32,38.27 28.32,37.89 | 29.84,43.85 26.67,43.85 | 26.67,43.85 26.54,43.73 | IC5.4 33.78,35.85 32.77,34.84 v32.26,34.84 31.11,34.84 29.97,33.7 IC5.8 | C7.1 24.77,45.51 26.54,43.73 | v27.56,37.76 28.32,37.76 28.32,37.89 | IC8.5 31.62,46.01 | 31.62,46.01 31.62,45.63 29.84,43.85 | 31.62,46.01 28.96,46.01
  pour Bottom: 31.62,46.27 24.13,46.27 24.13,40.3 25.53,40.3 25.53,42.84 25.91,43.22 31.5,43.22 31.5,46.14
+12V  (via drill 0.6)  (2 unrouted)
  Top 0.406: IC1.IN 61.72,3.34 | 66.55,5.5 66.52,5.5
  Top 0.61: v87,48.17 89.15,45.66 89.28,33.44 88.65,32.68 81.66,32.68 79.88,32.17 76.07,28.49 v73.79,26.33 76.83,24.3 76.83,22.65 75.06,20.36 75.06,18.96 75.31,16.93 75.31,15.15 74.17,14.52 74.17,11.6 75.31,10.2 v75.31,8.42 75.18,8.42 72.9,6.14 67.15,6.14 2.1 | 61.72,3.34 64.52,3.34 66.55,5.5 | JP3.2 30.23,25.57 33.53,25.57 35.18,26.96 v35.37,26.27
  Top 0.711: 41.97,28.97 36.77,28.97
  Top 0.813: v87,48.17 X3.1
  Top 1.016: v54.74,28.49 53.85,27.98 44.7,27.98 44.2,28.49 v43.69,28.49 41.97,28.97 | 36.77,28.97 v35.37,27.54
  Top 1.422: v35.37,27.54 v35.37,26.27
  Bottom 0.406: IC3.16 87,46.4 v87,48.17 | R20.1 79.25,10.07 78.49,9.31 R21.1 | IC2.3 60.48,2.35 61.21,2.83 IC1.IN | Q2.3 48.01,45.02 Q4.3 | Q1.3 4.42,22.42 Q3.3 | R31.2 3.3,35.6 | R30.2 3.3,38.9 | 21.72,39.41 IC9.3 | R22.1 26.8,21.5 26.8,23.03 | U$3.2 9.14,37.38 9.02,37.25 | R29.2 3.3,42.2
  Bottom 0.61: 2.1 TP12.TP 69.91,6.14 | 69.72,28.87 59.94,28.87 | R21.1 v75.31,8.42 | 3.3,40.55 7.75,40.55 8.64,41.06 12.83,41.06 13.84,40.86 20.27,40.86 21.72,39.41 | 26.8,23.03 27.43,23.66
  Bottom 0.711: 69.72,28.87 72.52,26.33 | 59.94,28.87 59.18,28.11
  Bottom 0.813: 72.52,26.33 v73.79,26.33 | 59.18,28.11 55.75,28.11 v54.74,28.49 | 29.91,26.2 28.07,25.82 26.54,25.19 | Q4.3 44.7,43.98 44.73,39.44 43.92,38.16 43.94,31.03 43.94,29 v43.69,28.49 | Q3.3 3.53,24.17 5.21,24.17 | 27.43,23.66 JP3.2 | 9.02,37.25 3.3,37.25
  Bottom 1.016: R28.2 3.3,45.38 3.3,42.2 3.3,40.55 3.3,38.9 3.3,37.25 3.3,35.6 3.3,30.77 4.32,30.14 5.21,28.87 5.21,24.17 12.95,24.17 14.63,26.96 X1.6 18.05,27.22 20.95,25.69 23.88,25.69 24.89,25.19 26.54,25.19 | 35.31,26.2 29.91,26.2
+12V1
  Bottom 0.406: IC10.7 R32.1 R44.1
GND  (via drill 0.6)
  Top 0.61: X2.1 92.08,6.39 R39.2
  Top 1.27: v50.04,26.46 42.67,26.46 42.16,26.84 41.02,26.84
  Bottom 1.27: 37.21,27.03 42.86,27.03
  other vias: 36.2,30.39 72.52,12.61 80.52,34.2 1.27,42.33 58.17,10.2 55.37,24.68 94.36,17.95 94.87,35.98 20.7,5.12 61.72,25.06 49.02,7.66 67.94,1.18 79.38,28.49 34.16,22.01 21.34,49.06 69.72,24.8 66.67,31.16 43.18,41.31 14.48,38.14 20.57,13.25 72.01,28.49 46.1,34.08 19.94,29.12 23.88,35.73 21.34,42.2 8,32.17 19.94,24.8 43.81,5.5 22.23,22.65 31.11,5.12 70.1,20.74
  pour Bottom (rank 3): 0,50.08 95.89,50.08 96.01,6.9 95.5,5.88 86.11,5.88 82.93,5.5 82.93,0.17 0,-0.09
  pour Top: 0,50.08 95.89,50.08 95.89,-0.09 0,-0.09
N$1  (via drill 0.6)  (1 unrouted)
  Top 0.61: 56.64,27.6 54.23,26.46 53.21,23.28 46.35,23.28 43.69,25.01 37.47,25.01 36.58,24.04 36.2,23.03 35.81,20.87 23.37,20.87 19.81,21.12 14.73,21.12 12.45,18.84 12.45,13.12 v12.19,12.87 | 56.64,29.88 57.53,30.65 59.18,32.3 JP4.2
  Top 0.813: 56.64,27.6 56.64,29.88 | 2.9 65.46,34.14 59.24,34.14 59.24,32.62 JP4.2
  Bottom 0.61: 5.59,11.22 7.24,12.87 v12.19,12.87 12.32,12.87
  Bottom 0.813: 5.12,5.63 D12.1 | D12.1 5.25,5.67 5.84,6.26 5.84,10.58 D2.1 5.59,11.22 | JP2.1 5.25,5.76 D12.1
  Bottom 1.016: 64.77,32.74 65.9,32.92 65.94,32.92 2.9
N$2  (via drill 0.6)
  Top 0.406: 36.26,44.82 42.29,44.82 45.59,44.87 66.29,44.87 67.31,43.35 68.71,43.35 71.63,41.76
  Top 0.61: X1.4 17.85,34.97 20.8,34.97 33.88,44.82 36.26,44.82 | 71.63,41.76 76.26,38.97 78.49,38.97 v80.96,39.41 81.03,39.35 84.58,39.35 86.23,40.24 86.23,45.51 84.77,46.71 81.6,46.71 80.96,47.35 X3.2
  Bottom 0.406: v80.96,39.41 84.45,39.41 85.72,38.77 IC3.10 | U$3.1 10.47,36.17 10.41,35.6 | 10.41,35.6 R31.1 | 10.41,35.6 10.79,35.47 14.35,35.47 14.86,34.97 17.57,34.97 X1.4
N$3  (via drill 0.6)
  Top 0.406: 35.24,46.52 37.02,48.55 43.24,48.55 48.7,46.4 74.61,46.4 75.75,45.38 78.49,43.09 79.63,43.09 80.87,42.21 | v83.82,42.27 83.5,41.95 81.92,41.95 80.87,42.21 | 78.74,46.4 80.33,44.81 80.33,42.75 80.87,42.21
  Top 0.61: X1.3 18.02,39.09 23.56,39.09 33.02,46.52 35.24,46.52 | X3.3 78.42,46.71 78.74,46.4
  Bottom 0.406: IC3.13 84.77,42.59 84.14,42.27 v83.82,42.27 | 12.88,38.65 U$3.4 12.95,38.65 12.95,39.41 13.08,39.54 | 15.28,39.62 13.17,39.62 13.08,39.54 | R30.1 8.13,38.9 8.13,39.41 8.76,40.05 12.57,40.05 13.08,39.54
  Bottom 0.61: X1.3 15.28,39.62
N$4  (1 unrouted)
  Top 0.406: 37.27,21 41.91,21
  Top 0.61: X1.8 20.6,19.06 22.86,16.55 27.72,11.69 32.67,11.69 37.27,21 | 41.91,21 55.88,21 60.2,26.46 60.33,26.58 60.52,26.65
  Bottom 0.406: 2.7 64.77,27.98 61.47,27.98 60.49,26.75
  Bottom 0.61: TP22.TP 66.81,26.71 2.7 | 60.49,26.75 LED6.A
N$5  (via drill 0.6)  (2 unrouted)
  Top 0.61: Q5.3 87.35,15 83.31,10.96 81.68,10.96 80.6,9.88 80.6,8.34 v82.04,7.41
  Bottom 0.305: 71.88,4.23 79.22,4.23
  Bottom 0.406: Q8.3 71.88,4.23 | 79.22,4.23 79.76,5.37 79.76,7.91
  Bottom 0.61: T1.1 85.47,11.85 84.58,10.96 81.28,10.96 79.76,8.93 | v82.04,7.41 80.01,8.17 R21.2
N$6  (via drill 0.6)
  Top 0.406: v54.99,14.52 49.53,12.99 46.48,10.2 v44.7,10.2 | v32,13.5 32,16.04 U$2.1
  Bottom 0.406: 57.53,25.31 D8.2 56.72,23.48 55.88,22.39 55.88,17.06 v54.99,14.52 53.47,12.74 IC7.2 | Q10.1 25.4,17.18 27.37,17.18 | 27.37,17.18 29.59,17.18 30.35,17.95 | v44.7,10.2 44.7,10.45 43.18,11.98 42.42,11.98 41.4,12.99 37.59,12.99 36.07,11.47 33.53,11.47 v32,13.5 | R22.2 28.77,21.25 27.37,19.85 27.37,17.18
  Bottom 0.813: 30.35,17.95 U$2.1
N$7
  Bottom 0.406: IC10.2 28.83,5.5 27.81,4.49 R2.2
N$8
  Bottom 1.27: R27.2 R28.1
N$9  (via drill 0.6)  (1 unrouted)
  Top 0.406: v78.23,14.77 78.99,14.77 81.03,14.01 81.03,11.98 79.5,10.2 79.5,7.66 81.79,5.63 v81.79,4.87
  Top 0.61: Q6.3 92.48,24.91 90.55,25.95 86.23,25.95 85.6,24.42 85.6,18.07 81.53,18.07 v78.23,14.77
  Bottom 0.406: v81.79,4.87 82.8,4.36 Q7.3
  Bottom 0.61: T1.3 85.47,14.9 83.57,12.99 83.57,14.01 83.31,14.26 78.74,14.26 v78.23,14.77
N$10  (1 unrouted)
  Bottom 0.61: 92.96,17.57 92.96,15.03
  Bottom 3.175: 89.92,17.06 89.92,14.52
N$11  (via drill 0.6)  (2 unrouted)
  Top 0.813: X1.5 16.8,30.94 14.22,28.36 14.22,24.8 12.45,23.03 12.45,21.88 v12.32,21.76
  Bottom 0.406: Q3.2 8.51,20.11
  Bottom 0.61: START.TP 11.18,21.12
  Bottom 0.813: v12.32,21.76 8.51,20.11 | D15.2 9.78,32.3 11.56,32.42 13.91,30.84 17.53,30.84 X1.5
N$12  (1 unrouted)
  Top 0.711: 37.21,5.2 41.53,5.2
  Top 0.813: X1.12 17.79,3.21 32.13,3.21 37.21,5.2 | 41.53,5.2 42.29,4.31 43.05,3.47 56.13,3.47 60.45,7.66 62.36,7.66 LED1.K 2.2
  Bottom 0.61: TP16.TP 2.2 | 18.29,3.21 10.27,3.21 D13.2
N$13  (1 unrouted)
  Top 0.406: 62.95,13.93 62.48,14.11 58.93,14.11 57.66,15.79
  Top 0.61: 62.95,12.74 62.95,13.93 | 57.66,15.79 50.48,15.79 46.23,12.23 45.72,11.72 43.69,11.72 43.18,11.22 43.18,10.45 41.9,9.17 41.73,9.17
  Top 0.711: 41.73,9.17 36.97,9.17
  Top 0.813: 2.3 62.95,12.74 | 36.97,9.17 36.56,9.17 34.8,7.15 21.43,7.15 X1.11
  Bottom 0.61: TP17.TP 2.3 | X1.11 14,7.18 12.57,6.14 D12.2
N$14  (1 unrouted)
  Top 0.406: 58.04,16.8 59.44,14.92 62.61,14.92 62.93,16.23
  Top 0.61: 43.81,13.11 49.53,16.8 58.04,16.8
  Top 0.711: 36.51,13.11 43.81,13.11
  Top 0.813: X1.10 17.8,11.15 22.16,11.15 24.38,8.93 33.97,8.93 36.51,13.11 | 62.93,16.23 70.19,16.25 2.4
  Bottom 0.61: TP18.TP 72.28,16.23 2.4 | X1.10 18.28,11.14 18.29,11.15 16.55,11.15 16.17,11.22 D2.2
N$15
  Bottom 0.406: Q4.2 Q2.2 52.7,42.71 52.7,42.46
  Bottom 0.813: IC4.3 52.7,42.46
N$16
  Bottom 0.406: 50.52,7.66 50.52,6.39 IC7.8 | 50.52,7.66 IC7.6 | 50.52,7.66 50.52,8.7 49.02,10.2 49.02,14.77 46.99,17.44 46.86,17.57 46.23,17.95 46.23,20.11 46.61,20.23 47.37,20.23 48.51,21.25 48.51,25.19 47.5,26.2 R5.1
N$17  (via drill 0.6)
  Top 0.406: 34.54,48.3 35.43,49.29 44.39,49.29 49.4,47.22 75.56,47.22 v79.06,44.17 | v9.14,38.9 11.43,38.9 15.24,42.71 17.53,42.71 X1.2
  Top 0.61: X1.2 17.87,42.9 19.94,43.16 22.73,46.52 26.92,46.52 31.88,48.3 34.54,48.3 | X3.4 75.56,48.94 75.56,47.22
  Bottom 0.406: IC3.12 84.77,41.31 84.14,41 82.55,41 79.69,42.59 v79.06,44.17 | R29.1 10.67,42.2 11.18,42.71 14.73,42.71 | U$3.3 9.78,38.33 v9.14,38.9
  Bottom 0.61: 14.73,42.71 17.53,42.71 X1.2
N$18
  Bottom 0.406: IC3.15 88.9,45.12 89.79,44.11 89.79,36.62 90.55,35.73 90.55,24.8 91.69,23.28 IC6.5
N$19
  Top 0.61: 62.87,43.73 65.09,39.03 66.36,39.03 67.12,38.27 67.5,37.76 70.29,34.9 70.29,31.54 | 71.27,30.52 2.8
  Top 0.813: X1.14 43.58,42.82 45.72,43.73 62.87,43.73 | 70.29,31.54 71.27,30.52
  Bottom 0.406: 69.39,30.69 69.3,29.88 63.18,29.88 63.18,30.06 LED7.K | 62.99,33.84 61.8,34.73 D14.2
  Bottom 0.61: LED7.K 62.99,33.84
  Bottom 1.016: 2.8 TP23.TP 69.39,30.69
N$20  (via drill 0.81)  (1 unrouted)
  Top 0.813: X1.17 43.78,30.81 43.81,30.77 45.97,29.76 46.74,29.25 53.34,29.25 54.86,30.9 54.86,35.35 v59.05,37.51
  Bottom 0.813: 64.39,35.73 63.5,36.87 59.94,36.87 v59.05,37.51 57.28,38.88
  Bottom 1.016: 1.9 75.19,33.75 TP9.TP 70.94,34.19 69.22,35.6 65.28,35.6 64.39,35.73
N$21  (via drill 0.6)
  Top 0.61: X1.19 42.98,23.02 45.47,22.14 54.93,22.14 58.61,26.46 v58.61,29.57
  Bottom 0.61: 68.01,44.55 68.01,44.87 58.12,44.87 57.28,44.49 | 57.28,44.49 57.28,41.44 55.18,40.05 55.18,31.16 56.33,30.08 v58.61,29.57 | D11.1 57.28,44.49
  Bottom 1.016: 68.01,44.55 69.09,43.47 70.17,41 TP11.TP 74.93,40.68 76.8,40.68 1.11
N$22
  Bottom 0.406: IC8.11 32.89,43.35 33.4,43.85 34.92,43.85 | 34.92,43.85 35.43,43.35 IC8.9 | 34.92,43.85 34.92,44.11 35.56,44.8 42.67,44.8 43.69,45.3 44.2,47.28 46.86,48.68 60.07,48.68 60.82,48.19 61.59,47.54 R35.2
N$23
  Bottom 0.406: X1.22 42.67,11.14 43.87,8.73 43.87,7.33 41.91,5.2 36.58,5.2 R1.2
N$24  (1 unrouted)
  Bottom 0.406: 26.29,1.56 31.24,1.56 32.26,3.09 R1.1 | IC10.3 27.56,5.76 26.16,4.36 26.16,3.09 | 26.16,3.09 26.16,1.56 | C8.1 26.16,3.09
N$25
  Bottom 0.406: IC6.13 85.6,24.55
  Bottom 0.61: TP6.TP 83.03,23.22 1.6 84.58,23.28 85.22,23.92 85.6,24.55
N$26
  Bottom 0.406: 1.7 80.27,25.23 84.84,25.19 85.47,25.82 IC6.14
  Bottom 0.61: TP7.TP 77.47,26.84 1.7
N$27  (via drill 0.6)  (1 unrouted)
  Top 0.406: 73.03,33.44 72.14,34.33 69.47,37.12 68.96,38.39 | 62.93,18.14 62.1,17.59 59.44,17.59 59.05,17.69 | v43.81,16.3 44.58,16.55 44.57,16.56
  Top 0.508: 73.03,33.44 73.79,32.3 | 68.71,18.14 62.93,18.14 | 59.05,17.69 49.28,17.69 44.57,16.56
  Top 0.61: 68.71,18.14 70.74,19.28 73.91,21.12 74.8,22.01 74.8,24.17 72.26,25.82 72.26,27.34 74.3,28.36 74.93,29.38 74.93,31.16 73.79,32.3 v71.88,32.42 | 2.11 66.77,40.59 68.96,38.39
  Bottom 0.406: TP26.TP 74.93,31.66 73.41,32.17 | R3.1 v43.81,16.3 42.67,16.3 41.91,17.06 38.1,17.06 36.58,18.58 36.58,20.61 35.69,21.76 R23.1
  Bottom 0.61: 73.34,32.17 v71.88,32.42
N$28  (via drill 0.6)
  Top 0.406: v43.43,19.34 44.96,19.34 45.21,19.6 56.64,19.6 v60.45,22.52
  Bottom 0.406: v60.45,22.52 61.34,22.14 70.1,22.14 71.22,23.25 2.6 | v43.43,19.34 41.66,21.12 37.59,21.12 36.83,21.88 36.83,24.93 33.27,24.93 32.77,25 30.16,25 29.65,24.55 29.65,22.9 30.61,22.01 30.61,20.87 | U$2.2 28.57,18.84
  Bottom 0.61: TP21.TP 72.3,23.22 2.6 | 28.57,18.84 30.61,20.87
N$29
  Bottom 0.61: JP3.1 R23.2
N$30
  Bottom 0.406: R25.2 C5.1 45.72,3.21 | IC7.9 45.59,7.53 45.09,6.9 45.09,4.74 45.72,4.1 45.72,3.21 | 45.72,3.21 R8.2
N$31
  Bottom 0.406: IC7.14 46.35,14.08 46.35,15.28 44.83,17.31 44.83,21.38 45.47,22.14 | R9.2 45.47,22.14 | 45.47,22.14 C9.2
N$32
  Bottom 0.305: 32.19,30.77 29.46,30.77
  Bottom 0.406: IC5.2 31.24,36.23 28.96,33.95 28.96,31.16 | 29.46,30.77 28.96,31.16 | 28.96,31.16 27.05,31.16 25.27,30.58 24.94,30.31 24.75,29.93 23.86,28.49 D3.2 21.97,27.94 C1.2 R24.1 21.84,35.09 20.32,36.68 13.97,36.62 13.78,36.43 U$3.6 | 32.19,30.77 32.51,31.16 IC5.6
N$34
  Bottom 0.61: LED6.K 64.62,25.35 R4.1
N$35
  Top 0.711: 44.2,32.91 36.64,32.91
  Top 0.762: 32.64,27.14 26.16,27.14
  Top 0.813: 44.2,32.91 45.72,32.93 IC4.1 | 33.38,30.88 32.64,27.14
  Top 1.016: 36.64,32.91 33.38,30.88 | X1.7 17.88,22.92 20.48,22.92 21.34,24.17 23.11,24.93 26.16,27.14
  Bottom 0.406: R5.2 47.5,32.21 IC4.1
  Bottom 0.61: R18.1 47.6,34.86 IC4.1
N$36
  Bottom 0.406: R9.1 44.96,25.69 44.96,37.63 46.25,40.2 46.74,40.2 Q4.1 49.02,40.4 Q2.1
N$37  (via drill 0.6)
  Top 0.406: 90.93,46.52 91.44,46.01 91.44,35.09 91.19,34.84 91.19,32.68 94.74,31.92 94.74,21 v90.93,21
  Top 0.61: v90.42,47.03 90.93,46.52
  Bottom 0.406: IC3.2 91.76,45.12 v90.42,47.03 | IC6.7 91.19,20.74 v90.93,21
N$38
  Bottom 0.406: 1.3 77.6,12.75 77.09,13.51 77.09,15.28 79.63,17.95 82.17,17.95 85.85,22.01 IC6.11
  Bottom 0.61: TP3.TP 77.79,12.52 1.3
N$39
  Bottom 0.406: 1.5 80.16,19.75 81.27,20.87 83.57,20.87 84.84,22.14 85.47,22.9 85.85,23.28 IC6.12
  Bottom 0.61: 1.5 77.56,21.4 TP5.TP
N$41
  Top 0.508: 64.39,25.57 64.39,27.6
  Top 0.61: LED1.A LED2.A | 64.39,25.57 64.39,25.19 62.23,21.5 LED4.A | 64.39,27.6 63.5,28.74 61.96,28.74 LED7.A
  Bottom 0.61: LED1.A 60.45,8.93 59.94,8.42 58.36,8.42 R11.1 | LED2.A LED3.A LED4.A
N$42
  Bottom 0.406: X1.16 37.53,34.9 37.47,34.84 34.92,30.65 34.92,30.01 R33.2
N$43
  Bottom 0.406: Q1.1 4.29,17.8 Q3.1 2.21,18.07 3.3,18.07 4.06,17.31 R13.2
N$44  (via drill 0.6)
  Top 0.406: v84.07,28.23 85.6,29.76 85.6,31.16 90.68,31.16 90.81,31.28 v92.71,31.28
  Bottom 0.406: IC6.2 IC6.1 93.6,29.02 93.6,31.16 | 93.6,31.16 93.6,33.7 90.68,36.74 90.68,42.97 91.57,43.85 IC3.3 | Q11.1 82.8,28.23 v84.07,28.23 | v92.71,31.28 92.84,31.16 93.6,31.16
N$45
  Bottom 0.406: C2.1 52.38,20.08 R10.1 R12.2
N$46  (1 unrouted)
  Bottom 0.406: 52.05,10.2 50.29,10.2 49.78,10.96 49.78,15.28 48.01,17.82 R12.1 48.26,20.01 C3.1
N$47
  Bottom 0.406: R17.2 R16.2 57.4,12.87 56.9,12.36 56.9,10.71 R15.1 54.99,8.93 IC7.5
N$48
  Bottom 0.406: R7.2 21.08,21.12 21.21,20.87 21.21,18.2 Q10.3
N$49
  Bottom 0.406: R17.1 57.78,17.82 57.78,20.03 D8.1
N$50  (via drill 0.6)
  Top 0.406: v92.33,33.44 92.26,33.44 92.32,33.49
  Top 0.61: 92.32,33.49 92.33,33.63 92.33,47.79 v92.71,48.3
  Bottom 0.406: IC6.4 91.89,24.55 91.44,25.19 91.44,31.09 v92.33,33.44
  Bottom 0.61: v92.71,48.3 92.71,46.4 IC3.1
N$52
  Bottom 0.406: 1.8 83.11,30.2 | Q11.3 80.77,27.6 80.77,29.63 80.33,30.08 TP8.TP
  Bottom 0.61: TP8.TP 83.01,30.2 | 83.19,30.2 83.01,30.2 | 83.01,30.2 1.8
N$53  (via drill 0.6)
  Top 0.813: X1.15 59.44,41.76 61.72,41.76 63.5,37.89 64.9,37.19 v65.41,37.19
  Bottom 0.61: TP25.TP 72.2,37.19
  Bottom 0.813: v65.41,37.19 72.2,37.19 2.10
N$54
  Bottom 0.813: D1.1 2.67,14.52 2.54,14.39
  Bottom 1.27: 2.54,14.39 2.03,13.88 2.03,9.95 R27.1
N$55
  Top 0.406: LED4.K 61.78,18.43 59.56,18.43 59.18,18.71 | 42.07,17.03 38.83,17.03 37.08,17.06
  Top 0.61: 2.5 LED4.K | 59.18,18.71 48.92,18.71 45.72,17.95 43.94,17.95 42.26,17.03 42.07,17.03 | X1.9 17.92,15.03 22.1,15.03 26.67,10.45 33.27,10.45 37.08,17.06
  Bottom 0.61: TP19.TP 64.14,18.86 65.02,19.75 2.5 | X1.9 15.8,14.77 10.98,14.77 D1.2
N$56  (1 unrouted)
  Bottom 0.406: IC3.14 88.27,43.85 88.9,43.22 88.9,36.36 89.66,35.35 89.66,24.3 91.57,22.01 93.34,22.01
N$57  (via drill 0.6)  (3 unrouted)
  Top 0.406: Q6.2 89.66,23.15 89.66,19.9 91.19,19.9 Q5.1
  Top 0.61: X2.2 v90.49,8.99 92.08,9.25 | Q6.1 Q6.2 | Q5.1 91.97,15.94 T1.6 93.02,10.76 92.46,10.2 92.46,9.37 R39.1
  Bottom 0.406: v90.49,8.99 94.74,9.25 94.74,14.77 94.36,14.9 | Q8.1 71.88,0.55 82.09,0.55 Q7.1 | 87.38,8.93 X2.2
  Bottom 0.61: T1.2 89.15,13.38 90.68,14.9 | T1.4 89.41,16.42 | X2.2 90.17,8.93 | 90.17,8.93 v90.49,8.99 | 90.17,8.93 92.01,8.93 R38.1 | 90.68,14.9 T1.6 94.36,14.9 | 90.68,14.9 89.41,16.42 | 86.11,7.41 87.38,8.93 | Q7.1 83.67,2.58 Q7.2 | 86.11,2.83 90.68,2.83 | 86.87,1.06 86.87,3.09 | 87.63,2.58 87.63,4.61 | 86.74,16.5 86.74,17.82 | 89.41,16.42 92.96,16.42
  Bottom 0.813: 86.11,2.83 86.11,7.41
  Bottom 1.27: 86.06,17.95 92.71,17.95
  pour Bottom: 82.55,5.12 93.98,5.12 93.98,0.04 82.55,0.04
N$58
  Top 0.61: X1.24 36.71,3.22 TACHO_BEL.TP
N$59  (1 unrouted)
  Top 0.61: Q5.2 89.66,12.49 87.68,12.49 84.59,9.39 83.2,9.39 1.2
  Bottom 0.406: Q8.2 79.5,2.58 81.03,6.14 83.57,6.14 TP2.TP
  Bottom 0.61: TP2.TP 83.69,8.42 83.69,9.05 1.2 85.09,9.44 86.87,10.45 88.65,10.45 89.92,11.72 93.22,11.72 93.09,11.85 | T1.8 93.09,11.85 | 93.09,13.25 93.09,11.85 | 91.69,13.12 92.58,13.38 | 74.93,1.69 76.33,1.69 | 74.93,3.47 76.33,3.47
  pour Bottom: 72.14,3.85 78.99,3.85 80.26,5.12 80.77,14.52 94.49,14.52 94.49,9.44 86.87,9.44 82.8,5.37 82.8,5.12 82.3,4.61 82.3,0.8 72.14,0.8
N$61  (1 unrouted)
  Bottom 0.305: 93.22,25.82 94.87,25.82 94.87,29.25 94.49,29.76
  Bottom 0.406: 94.49,29.76 94.49,34.08 91.52,37.06 91.52,40.05 IC3.6
N$63
  Bottom 1.422: 35.43,26.33 35.43,27.47
N$64
  Bottom 0.61: IC4.2 R18.2
N$65
  Bottom 0.406: R26.2 35.43,35.98 34.67,35.09 33.78,34.02 IC5.5
N$67
  Bottom 0.406: IC6.10 85.85,20.74 84.84,19.47 84.84,18.03 1.4
  Bottom 0.61: TP4.TP 83.04,16.23 1.4
N$69
  Top 0.406: 13.97,0.67 43.37,0.67
  Top 0.508: 57.21,1.63 65.91,1.63
  Top 0.61: 56.13,1.18 57.21,1.63
  Top 0.813: 12.06,6.01 13.08,4.99 13.08,2.01 13.97,0.67 | 46.74,1.18 56.13,1.18
  Top 1.016: X1.1 15.49,46.71 13.59,45.12 13.59,44.55 5.59,39.03 5.59,5.88 12.06,6.01 | 43.37,0.67 46.74,1.18 | 65.91,1.63 67.75,3.28 73.43,3.28 1.1
  Bottom 0.61: TP1.TP 1.1
N$70
  Top 0.813: 74.68,26.71 74.68,26.2
N$83
  Bottom 0.406: 51.05,3.34 51.05,4.74 IC7.7 | 49.97,3.53 R25.1 49.78,3.34 51.05,3.34 | 51.05,3.34 52.07,3.34 R6.1
N$84  (via drill 0.8)  (1 unrouted)
  Bottom 0.406: 44.32,13.12 R3.2 43.31,13.38 41.66,15.03 39.71,15.03 X1.21 39.56,15.03 34.8,15.03 34.54,13.76 | Q9.2 T3.C
  Bottom 0.61: 34.54,13.76 Q9.2
  Bottom 0.813: IC6.16 87.12,28.36 v87.12,30.01
N$85  (1 unrouted)
  Bottom 0.406: Q9.1 31.76,16.06 30.85,15.28 R32.2 | 33.02,16.75 33.02,17.84 T3.B
N$86
  Bottom 0.406: R26.1 35.05,39.41 32.51,39.41 | 32.51,39.41 IC5.3 | IC8.12 31.62,40.3 32.51,39.41
N$87
  Bottom 0.406: R33.1 32.89,27.66 27.56,27.66 26.67,27.34 D3.1
N$88  (via drill 0.6)
  Top 0.406: v84.33,26.58 81.53,25.19 80.52,25.19 79.76,24.42 79.76,21.63 80.52,20.87 80.52,19.34 76.71,15.53 76.71,15.03 75.18,13.5 75.18,12.11 76.96,10.33 76.96,8.42 72.9,4.36 66.8,4.36 64.77,2.4 59.44,2.4 57.91,2.45 45.21,2.45 42.16,1.39 14.99,1.39 14.22,2.33 14.22,16.3 v14.73,17.31
  Bottom 0.406: IC6.15 86.97,26.96 85.22,26.96 84.84,26.58 v84.33,26.58 | R13.1 v14.73,17.31
N$89
  Bottom 0.406: IC8.14 29.08,40.3 26.42,38.65 26.42,37.25 R34.1 | 25.53,35.85 R34.1 | C10.1 27.3,33.82 25.53,35.22 R34.1
N$90  (1 unrouted)
  Bottom 0.254: R35.1 67.31,47.54
  Bottom 0.406: 69.22,47.54 70.87,46.03 2.12 72.27,44.24 TP13.TP
N$92
  Bottom 0.406: IC10.1 30.1,8.55 29.46,9.18 R42.2
N$93  (via drill 0.6)
  Top 0.711: 41.78,36.87 36.45,36.87
  Top 0.813: v60.58,40.43 59.18,40.43 41.78,36.87 | 36.45,36.87 32.64,32.91 30.99,31.26 JP1.1
  Bottom 0.813: D11.2 60.75,41.06 D10.2 61.72,38.9 v60.58,40.43
  Bottom 1.016: 1.10 TP10.TP 77.98,36.62 76.46,38.13 73.6,39.09 69.85,39.09 69.53,38.77 63.75,38.77 63.25,41.06
  Bottom 1.93: 63.25,41.06 60.75,41.06
N$94
  Top 0.813: 8.64,27.6 R36.2 | 8.64,27.6 R37.2 | JP1.2 28.45,31.28 26.92,32.93 14.61,32.93 9.4,27.6 8.64,27.6
N$95
  Bottom 0.813: JP2.2 2.79,3.21 3.68,3.09 D13.1
N$96
  Bottom 0.406: C11.1 R42.1 R43.1
N$97
  Bottom 0.406: IC10.5 26.1,12.29 25.27,13.12 | 25.27,13.12 24.64,13.76 24.64,15.66 R44.2 | R43.2 24.13,11.98 25.27,13.12
N$98
  Bottom 0.406: 57.78,34.82 57.32,34.82 D14.1
  Bottom 0.61: JP4.1 56.64,34.41 D14.1
N$99
  Bottom 0.406: 24.38,21.25 24.38,19.98 | R7.1 24.38,21.25 | 24.38,21.25 24.38,23.54 24,24.04 R14.1
  Bottom 0.813: 24.38,19.98 U$2.3
N$101
  Bottom 0.406: R45.1 34.42,8.8 32.77,7.15 32.77,6.52 R46.2 32.64,7.15 31.24,8.17 31.24,9.44 30.48,10.2 28.19,10.2 27.69,10.71 27.69,12.16 IC10.6
N$580  (1 unrouted)
  Bottom 0.406: 51.69,14.01 52.7,15.03 52.7,16.23 R19.2 53.97,17.95 R10.2
VCC  (via drill 0.6)  (1 unrouted)
  Top 0.406: v42.93,7.91 45.09,7.91 46.74,6.64 47.12,6.26 53.85,6.26 54.61,7.03 v55.5,7.03
  Top 0.61: v55.5,7.03 55.5,12.61 v55.88,13.12
  Bottom 0.406: R19.1 50.74,16.23 50.57,15.15 50.57,11.47 IC7.3 54.36,11.47 54.86,11.98 54.93,11.98 R15.2 | R6.2 53.59,2.33 53.59,4.87 54.48,5.5 54.73,5.75 54.73,6.26 | IC2.1 59.53,5.73 60.07,6.14 | R45.2 32.64,10.58 | 32.64,10.58 30.99,12.23 30.16,12.23 IC10.8 | 32.64,10.58 35.43,10.58 36.83,9.18 42.16,9.18 v42.93,7.91
  Bottom 0.61: v55.88,13.12 R15.2 | 60.07,6.9 58.17,6.9 | 58.17,6.9 56.64,6.9 | C4.1 62.23,6.14 | R11.2 58.17,6.9
  Bottom 0.813: 60.07,6.9 60.07,6.14 IC1.OUT 62.23,6.14 | 56.64,6.9 55.37,6.9 | 55.37,6.9 v55.5,7.03 | 54.73,6.26 55.37,6.9

### Text on the board
Top: top | BEP V3.1 / maru-labs.com
tPlace: QC
bPlace: 4 | 3 | 2 | 1 | b | c | 5 | a | 5 | 4 | 3 | 1 | 2
tNames: GND c b a 12V | GND / BT / HiB | BL <> / Resistor | RPM | RPM / SPD / HiB | WRN | 18 | solder / bridge to / enable / Bulb Test / on WRN | 19 | 2.7 / 2.6 | 1.12 GND / 1.11< / 1.10<> / 1.9 > / 1 8 N / 1.7 G5 / 1.6 G4 / 1.5 G3 / 1.4 G2 / 1.3 G1 | 1.2 CC | 1 BAT / 2 GC / 3 GB / 4 GA / / / 7 RES / 8 ABS / 9 ALT / 10 TMP / OIL | solder / bridge to / enable / Choke / on WRN | BT / / / ALT / TMP / OIL / CHK / SWP | 1.1 BAT | CHK | 2.12 / 2.11 / 2.10 / / / / / 2.5 / 2.4 / 2.3 / 2.2 / 2.1 | 13 / 14 / 15 / 16 / 17 / / / / 21 SPDin / 22 SPDout / 23 / 24
bNames: 78L10 | N | BSS138 | N | BSS138 | 78L06 | < / / > / / G5 / / G3 / / G1 / / / BAT | GND / / <> / / N / / G4 / / G2 / / CC
tValues: 2.2 kOhm / SPD / pull-up / (middle / switch ) | OFF/ ON | > | ABS | OFF/ ON | > | BAR/ RES | BAR/RES | mode / selector
bValues: BA | M7 | M7 | SS12 | M7 | M7 | M7 | BA | or4701 | M7 | 6,8 | 2.4V/1.1V | 4 | SS12 | 13 GND / 14 BT / 15 HiB / 16RPM / 17 > / 18 GND / 19 < / / 21SPD in / 22SPD out / 23 GND | SS12 | 6V | SPD / / WRN / / ABS / / ALT / / OIL / / SWP | RPM / / HiB / / BT / / BAR / / TMP / / CHK | 1 BAT / 2 GC / 3 GB / 4 GA / 5 START / 6 SWP / 7 RES / 8 ABS / 9ALT / 10 TMP / 11 OIL / 12 CHK | BA | SS12 | BA | 4.7V
tStop: BEP V3.0 / maru-labs.com